# EAGLE design ONLY_HBRIDGE v4 (EAGLE 9.7.0)
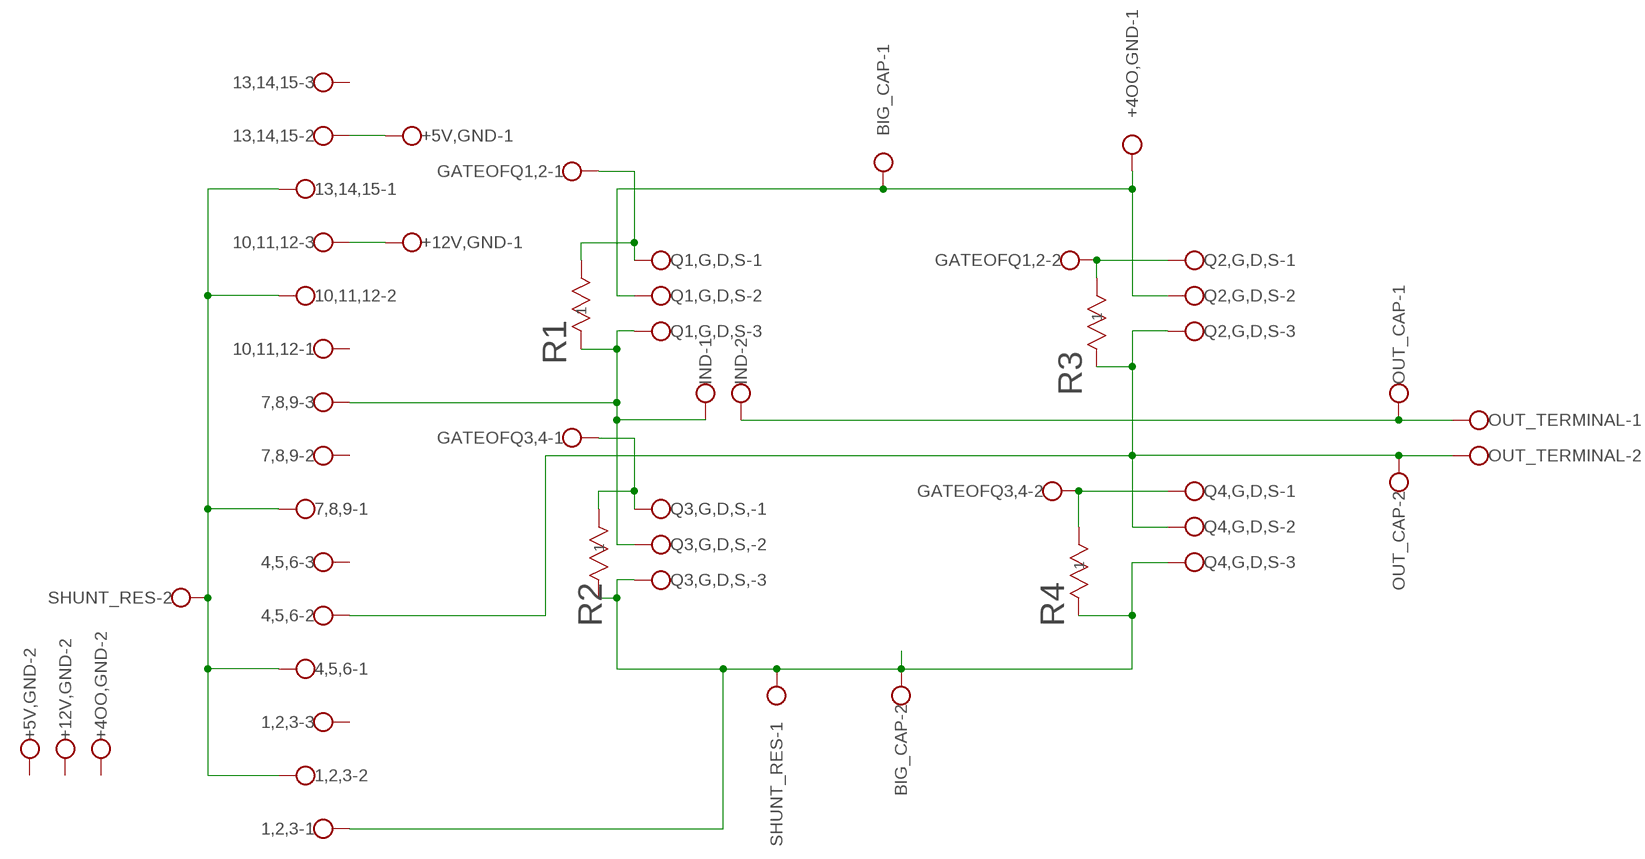
[diagram p0: schematic, sheet 1]

## Parts
1,2,3  W237-03P  [W237-133]
4,5,6  W237-03P  [W237-133]
7,8,9  W237-03P  [W237-133]
10,11,12  W237-03P  [W237-133]
13,14,15  W237-03P  [W237-133]
+4OO,GND  W237-02P  [W237-132]
+5V,GND  W237-02P  [W237-132]
+12V,GND  W237-02P  [W237-132]
BIG_CAP  W237-02P  [W237-132]
GATEOFQ1,2  W237-02P  [W237-132]
GATEOFQ3,4  W237-02P  [W237-132]
IND  W237-02P  [W237-132]
OUT_CAP  W237-02P  [W237-132]
OUT_TERMINAL  W237-02P  [W237-132]
Q1,G,D,S  W237-03P  [W237-133]
Q2,G,D,S  W237-03P  [W237-133]
Q3,G,D,S,  W237-03P  [W237-133]
Q4,G,D,S  W237-03P  [W237-133]
R1  CF14JT10K0STA_CF14_STP  [STA_CF14_STP]
R2  CF14JT10K0STA_CF14_STP  [STA_CF14_STP]
R3  CF14JT10K0STA_CF14_STP  [STA_CF14_STP]
R4  CF14JT10K0STA_CF14_STP  [STA_CF14_STP]
SHUNT_RES  W237-02P  [W237-132]

## Nets
N$1: GATEOFQ1,2.1 Q1,G,D,S.1 R1.2
N$2: GATEOFQ1,2.2 Q2,G,D,S.1 R3.1
N$3: 1,2,3.2 4,5,6.1 7,8,9.1 10,11,12.2 13,14,15.1 SHUNT_RES.2
N$4: GATEOFQ3,4.2 Q4,G,D,S.1 R4.1
N$5: GATEOFQ3,4.1 Q3,G,D,S,.1 R2.1
N$6: 1,2,3.1 BIG_CAP.2 Q3,G,D,S,.3 Q4,G,D,S.3 R2.2 R4.2 SHUNT_RES.1
N$7: 13,14,15.2 +5V,GND.1
N$8: 10,11,12.3 +12V,GND.1
N$9: +4OO,GND.1 BIG_CAP.1 Q1,G,D,S.2 Q2,G,D,S.2
N$10: 7,8,9.3 IND.1 Q1,G,D,S.3 Q3,G,D,S,.2 R1.1
N$11: IND.2 OUT_CAP.1 OUT_TERMINAL.1
N$12: 4,5,6.2 OUT_CAP.2 OUT_TERMINAL.2 Q2,G,D,S.3 Q4,G,D,S.2 R3.2
Unconnected: 1,2,3.3 4,5,6.3 7,8,9.2 10,11,12.1 13,14,15.3 +4OO,GND.2 +5V,GND.2 +12V,GND.2

## Library data of the parts
1,2,3 4,5,6 7,8,9 10,11,12 13,14,15 Q1,G,D,S Q2,G,D,S Q3,G,D,S, Q4,G,D,S = con-wago-508:W237-03P: WAGO SREW CLAMP
+4OO,GND +5V,GND +12V,GND BIG_CAP GATEOFQ1,2 GATEOFQ3,4 IND OUT_CAP OUT_TERMINAL SHUNT_RES = con-wago-508:W237-02P: WAGO SREW CLAMP
R1-R4 = 2024-12-04_14-13-54_Library:CF14JT10K0; COPYRIGHT: Copyright (C) 2024 Ultra Librarian. All rights reserved.; MANUFACTURER_PART_NUMBER: CF14JT10K0; MFR_NAME: Stackpole International

## Board
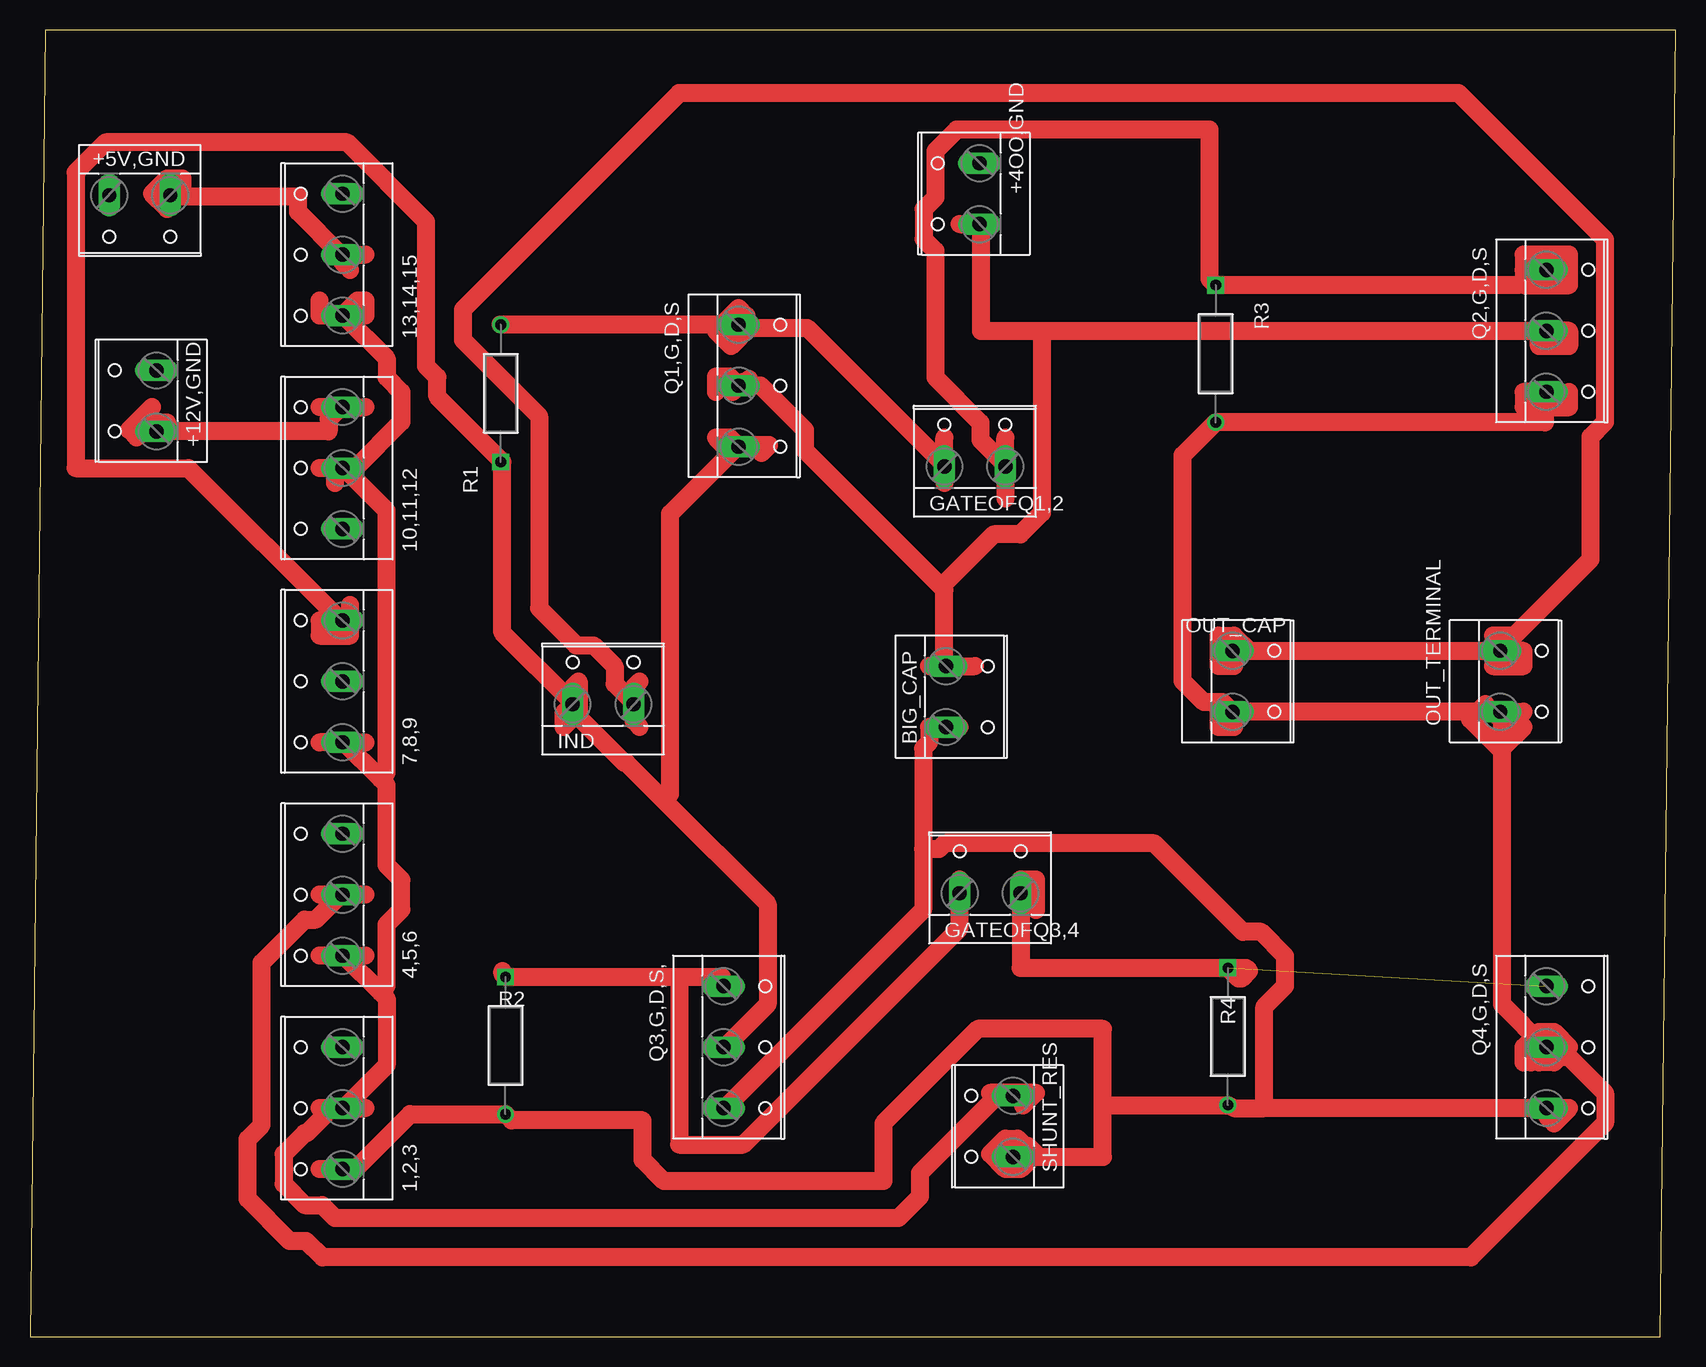
[diagram p1: board, top side]

Size 137.14 x 108.89 mm. Coordinates in mm from the lower left corner, seen from the top.
Outline: 0,0 135.87,0 137.14,108.89 1.27,108.89 0,0
Copper layers (1*16): Top 0.035mm / dielectric 1.5mm / Bottom 0.035mm
Design rules "Fusion Electronics Design Rules": minimum track width 1.5mm, minimum drill 0.35mm, track to track 0.5mm, track to pad 40mil, pad to pad 6mil, via to via 6mil, smd to smd 6mil, copper to edge 40mil, drill to drill 6mil, minimum pad ring 10mil, minimum via ring 8mil, stop-mask expansion 4mil, vias tented up to drill 9999mil, thermal gap 10mil

### Footprints (pad centres in the part's own frame; a part is rotated, then mirrored left to right if it is on the bottom)
W237-133 = drill 1.194 long: 1 -5.08,-0.635; 2 0,-0.635; 3 5.08,-0.635
W237-132 = drill 1.194 long: 1 -2.54,-0.635; 2 2.54,-0.635
STA_CF14_STP = drill 0.889 pad 1.397 square: 1 0,0 | drill 0.889 pad 1.397: 2 11.43,0

### Placement (x,y rotation side)
1,2,3  25.4,19.05 90 top
4,5,6  25.4,36.83 90 top
7,8,9  25.4,54.61 90 top
10,11,12  25.4,72.39 90 top
13,14,15  25.4,90.17 90 top
+4OO,GND  78.49,95.25 90 top
+5V,GND  9.14,94.49 180 top
+12V,GND  9.91,77.98 90 top
BIG_CAP  76.96,53.34 270 top
GATEOFQ1,2  78.74,73.15 0 top
GATEOFQ3,4  80.01,37.59 0 top
IND  47.75,53.34 0 top
OUT_CAP  100.84,54.61 270 top
OUT_TERMINAL  123.15,54.62 270 top
Q1,G,D,S  59.69,79.25 270 top
Q2,G,D,S  127,83.82 270 top
Q3,G,D,S,  58.42,24.13 270 top
Q4,G,D,S  127,24.13 270 top
R1  39.23,72.9 90 top
R2  39.62,29.97 270 top
R3  98.81,87.63 270 top
R4  99.82,30.73 270 top
SHUNT_RES  81.28,17.53 90 top

### Tracks (layer width: path | path; a pad name or v marks a point on that pad's centre or on a via)
N$1
  Top 1.5: R1.2 Q1,G,D,S.1 59.69,84.96 59.69,85.09 59.05,85.72 57.15,83.82 58.42,82.55 59.94,84.07 64.77,84.07 76.2,72.64 | 76.2,71.12 GATEOFQ1,2.1 76.2,72.64 | 76.2,72.64 76.2,74.93
N$2
  Top 1.5: GATEOFQ1,2.2 81.28,72.64 79.2,74.72 79.2,76.17 75.44,79.94 75.44,90.5 74.47,91.47 74.47,93.95 75.44,94.92 75.44,98.81 77.22,100.58 98.3,100.58 98.3,88.14 R3.1 124.03,87.63 124.49,88.09 125.43,88.09 126.24,88.9 | GATEOFQ1,2.2 81.28,69.85 | GATEOFQ1,2.2 81.28,74.93 | 126.24,88.9 Q2,G,D,S.1 126.36,88.27 127,87.63 | 126.24,88.9 124.46,88.9 | 128.27,88.9 127,88.9 127,87.63 | 127,87.63 128.27,87.63 128.27,90.17 124.46,90.17 124.46,87.63 127,87.63
N$3
  Top 1.5: 13,14,15.1 26.16,85.09 29.72,81.53 29.72,79.94 30.94,78.71 30.94,76.23 27.1,72.39 10,11,12.2 | 29.21,28.7 26.16,31.75 4,5,6.1 | 29.21,28.7 29.72,28.19 29.72,22.61 26.16,19.05 1,2,3.2 | 29.21,46.48 29.72,45.97 29.72,39.3 30.94,38.07 30.94,35.59 29.72,34.36 29.72,29.21 29.21,28.7 | 29.21,46.48 26.16,49.53 7,8,9.1 | 10,11,12.2 26.67,71.88 29.72,68.83 29.72,46.99 29.21,46.48 | 13,14,15.1 24.13,85.09 24.13,86.36 | 13,14,15.1 27.3,86.36 27.94,86.36 27.94,85.09 | 10,11,12.2 24.13,72.39 | 10,11,12.2 25.4,71.75 25.4,71.12 | 7,8,9.1 27.94,49.53 | 7,8,9.1 24.13,49.53 | 4,5,6.1 27.94,31.75 | 4,5,6.1 24.13,31.75 | 1,2,3.2 24.13,19.05 24.64,18.54 23.07,16.97 22.89,16.97 21.13,15.21 21.13,12.73 22.89,10.97 24.34,10.97 25.4,9.91 72.39,9.91 74.17,11.68 74.17,13.64 80.59,20.07 SHUNT_RES.2 80.26,20.07 80.01,20.32 83.82,20.32 82.77,19.27 | 1,2,3.2 27.94,19.05
N$4  (1 unrouted)
  Top 1.5: R4.1 82.55,30.73 GATEOFQ3,4.2 | GATEOFQ3,4.2 82.55,38.1 83.82,38.1 83.82,35.56 82.55,36.83 GATEOFQ3,4.2 | R4.1 101.35,30.73 101.6,30.48 100.97,29.85 100.71,29.85 R4.1
N$5
  Top 1.5: 54.1,29.97 57.66,29.97 57.66,29.21 Q3,G,D,S,.1 | 54.1,29.97 R2.1 39.37,30.23 39.37,30.48 | 54.1,29.97 54.1,16 59.44,16 77.47,34.04 GATEOFQ3,4.1 77.47,38.1
N$6
  Top 1.5: 74.42,40.64 74.42,49.02 74.93,49.53 74.93,50.8 BIG_CAP.2 77.47,50.8 | 74.42,40.64 74.42,35.56 57.91,19.05 Q3,G,D,S,.3 | 89.41,19.3 R4.2 100.33,19.05 102.87,19.05 | 89.41,19.3 89.41,14.99 83.82,14.99 82.3,16.51 81.28,16.51 80.01,15.24 81.28,13.97 82.55,13.97 83.82,15.24 83.19,15.88 81.92,15.88 81.28,15.24 81.53,14.99 SHUNT_RES.1 | 89.41,19.3 89.41,25.65 78.99,25.65 71.12,17.78 71.12,12.95 52.83,12.95 51.05,14.73 51.05,18.03 40.13,18.03 R2.2 31.68,18.54 27.1,13.97 1,2,3.1 24.13,13.97 | 74.42,40.64 75.77,40.64 76.23,41.1 93.7,41.1 101.06,33.73 102.59,33.73 104.6,31.72 104.6,29.24 102.87,27.51 102.87,19.05 | Q4,G,D,S.3 126.36,18.41 127,17.78 128.27,19.05 102.87,19.05
N$7
  Top 1.5: 13,14,15.2 25.91,90.17 22.35,93.73 22.35,95 11.68,95 +5V,GND.1 11.68,94.23 11.43,93.98 10.16,95.25 11.43,96.52 12.7,96.52 12.7,95.25 | 13,14,15.2 27.94,90.17 | 13,14,15.2 26.04,89.53 26.67,88.9
N$8
  Top 1.5: +12V,GND.1 24.89,75.44 24.89,76.45 25.91,77.47 10,11,12.3 | +12V,GND.1 10.16,75.82 10.16,76.2 11.43,76.2 | +12V,GND.1 9.4,75.44 8.89,74.93 8.26,75.56 10.16,77.47 | 10,11,12.3 27.94,77.47 | 10,11,12.3 24.13,77.47
N$9
  Top 1.5: 75.95,62.48 76.2,62.23 76.2,55.88 BIG_CAP.1 | 84.33,83.82 79.25,83.82 79.25,92.71 +4OO,GND.1 | 84.33,83.82 125.73,83.82 | 125.73,83.82 Q2,G,D,S.2 128.27,83.82 128.27,82.55 125.73,82.55 125.73,83.82 | 75.95,62.48 64.59,73.83 64.59,75.54 60.88,79.25 Q1,G,D,S.2 | Q1,G,D,S.2 58.55,78.74 | 59.91,79.79 59.66,79.55 59.36,79.55 Q1,G,D,S.2 | Q1,G,D,S.2 58.29,80.01 57.15,80.01 57.15,78.74 | +4OO,GND.1 80.01,92.71 | 77.47,92.71 +4OO,GND.1 | 75.95,62.48 80.31,66.85 82.52,66.85 84.33,68.66 84.33,83.82 | BIG_CAP.1 78.74,55.88 | BIG_CAP.1 74.93,55.88
N$10
  Top 1.5: 52.83,44.7 61.47,36.07 61.47,27.69 57.91,24.13 Q3,G,D,S,.2 | 52.83,44.7 53.34,45.21 53.34,68.58 59.05,74.3 61.59,74.3 60.96,73.66 60.45,74.17 Q1,G,D,S.3 | 26.67,60.96 26.67,58.42 24.13,58.42 24.13,59.69 7,8,9.3 25.91,59.69 13.21,72.39 3.81,72.39 3.81,97.03 6.3,99.52 26.42,99.52 33.02,92.92 33.02,80.88 33.94,79.95 33.94,78.33 39.23,73.04 R1.1 39.37,72.9 39.37,58.67 45.21,52.83 45.21,51.56 44.45,50.8 44.45,51.94 IND.1 45.21,54.1 45.72,54.61 45.72,51.64 49.56,47.8 49.74,47.8 52.83,44.7 | Q1,G,D,S.3 58.29,74.93 57.15,74.93 57.91,74.17 Q1,G,D,S.3
N$11
  Top 1.5: IND.2 50.29,52.83 48.72,54.4 48.72,55.85 46.96,57.61 45.51,57.61 42.42,60.71 42.42,76.71 36.07,83.06 36.07,85.6 54.1,103.63 119.05,103.63 131.27,91.41 131.27,76.23 130.05,75 130.05,64.77 122.68,57.4 OUT_TERMINAL.1 | OUT_TERMINAL.1 121.92,57.15 101.6,57.15 100.33,58.42 99.06,58.42 99.06,55.88 100.33,55.88 100.33,57.02 OUT_CAP.1 | IND.2 50.29,51.31 50.8,50.8 | IND.2 50.29,54.1 50.8,54.61 | OUT_TERMINAL.1 122.53,57.15 124.46,57.15 124.46,55.88 123.19,55.88 | 123.19,55.88 121.92,55.88 121.92,58.42 123.19,58.42 123.19,55.88
N$12
  Top 1.5: 126.24,77.47 126.24,76.2 R3.2 96.06,73.45 96.06,54.64 97.82,52.88 99.39,52.88 OUT_CAP.2 | OUT_TERMINAL.2 122.68,52.07 122.68,27.69 126.24,24.13 125.73,24.13 125.73,22.86 127,22.86 128.27,24.13 127,25.4 125.73,25.4 124.46,24.13 124.46,22.86 125.09,22.86 Q4,G,D,S.2 127.17,23.32 128.24,23.32 131.27,20.29 131.27,17.81 120.07,6.6 24.38,6.6 23.02,7.97 21.65,7.97 18.13,11.48 18.13,16.46 19.3,17.63 19.3,31.17 22.89,34.75 23.83,34.75 25.91,36.83 | OUT_CAP.2 121.92,52.07 123.19,50.8 124.46,52.07 124.45,52.08 OUT_TERMINAL.2 | 25.91,36.83 4,5,6.2 27.94,36.83 | 25.91,36.83 24.13,36.83 | OUT_CAP.2 99.06,52.07 99.06,50.8 100.33,50.8 | 126.24,77.47 128.27,77.47 128.27,78.74 | 126.24,77.47 124.46,77.47 124.46,78.74 Q2,G,D,S.3 127,78.74 | OUT_TERMINAL.2 123.18,52.08 124.46,50.8 122.56,48.89 120.02,51.44 121.28,52.7